# Altium schematic sheet senior_board_rev1.SchDoc
size 939 x 508 mm
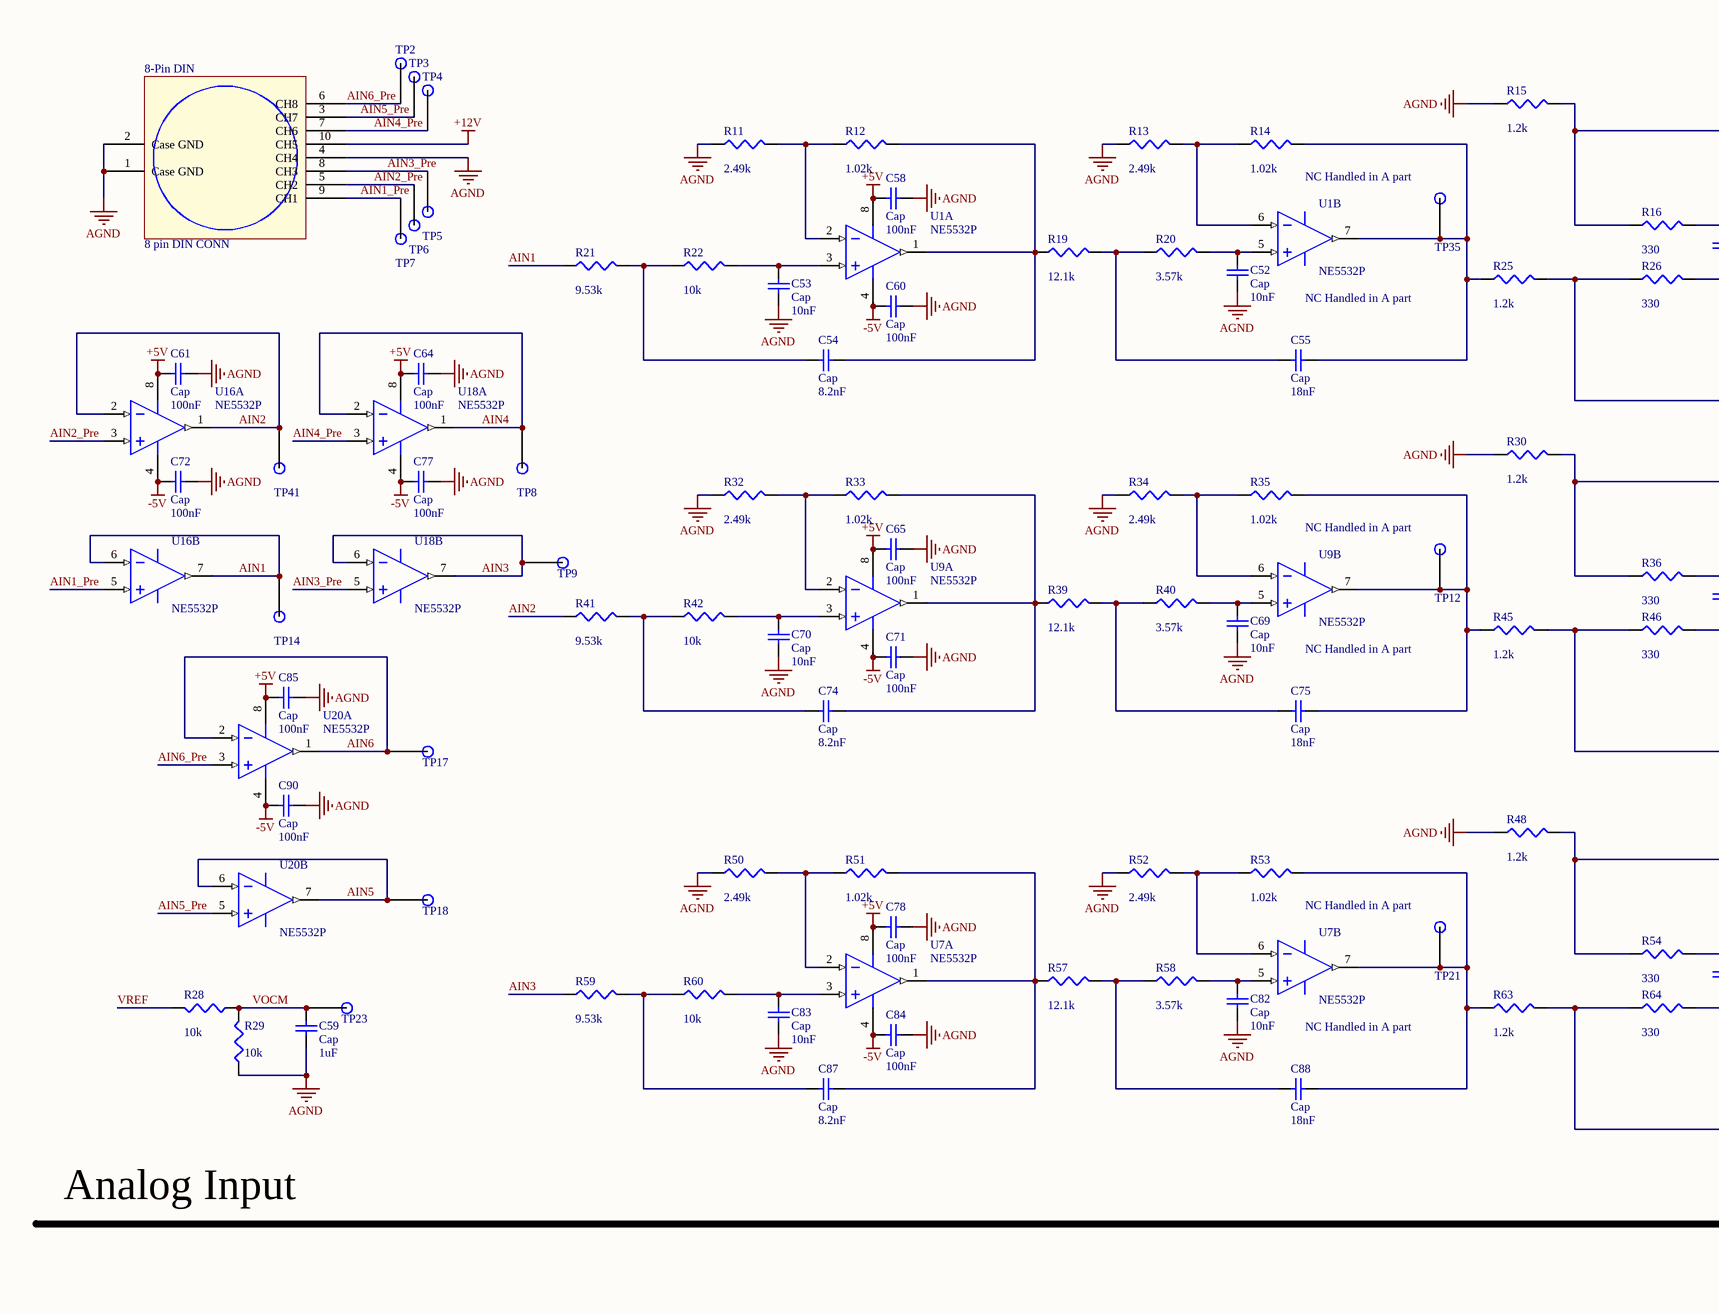
[diagram p0: senior_board_rev1.SchDoc, top left]
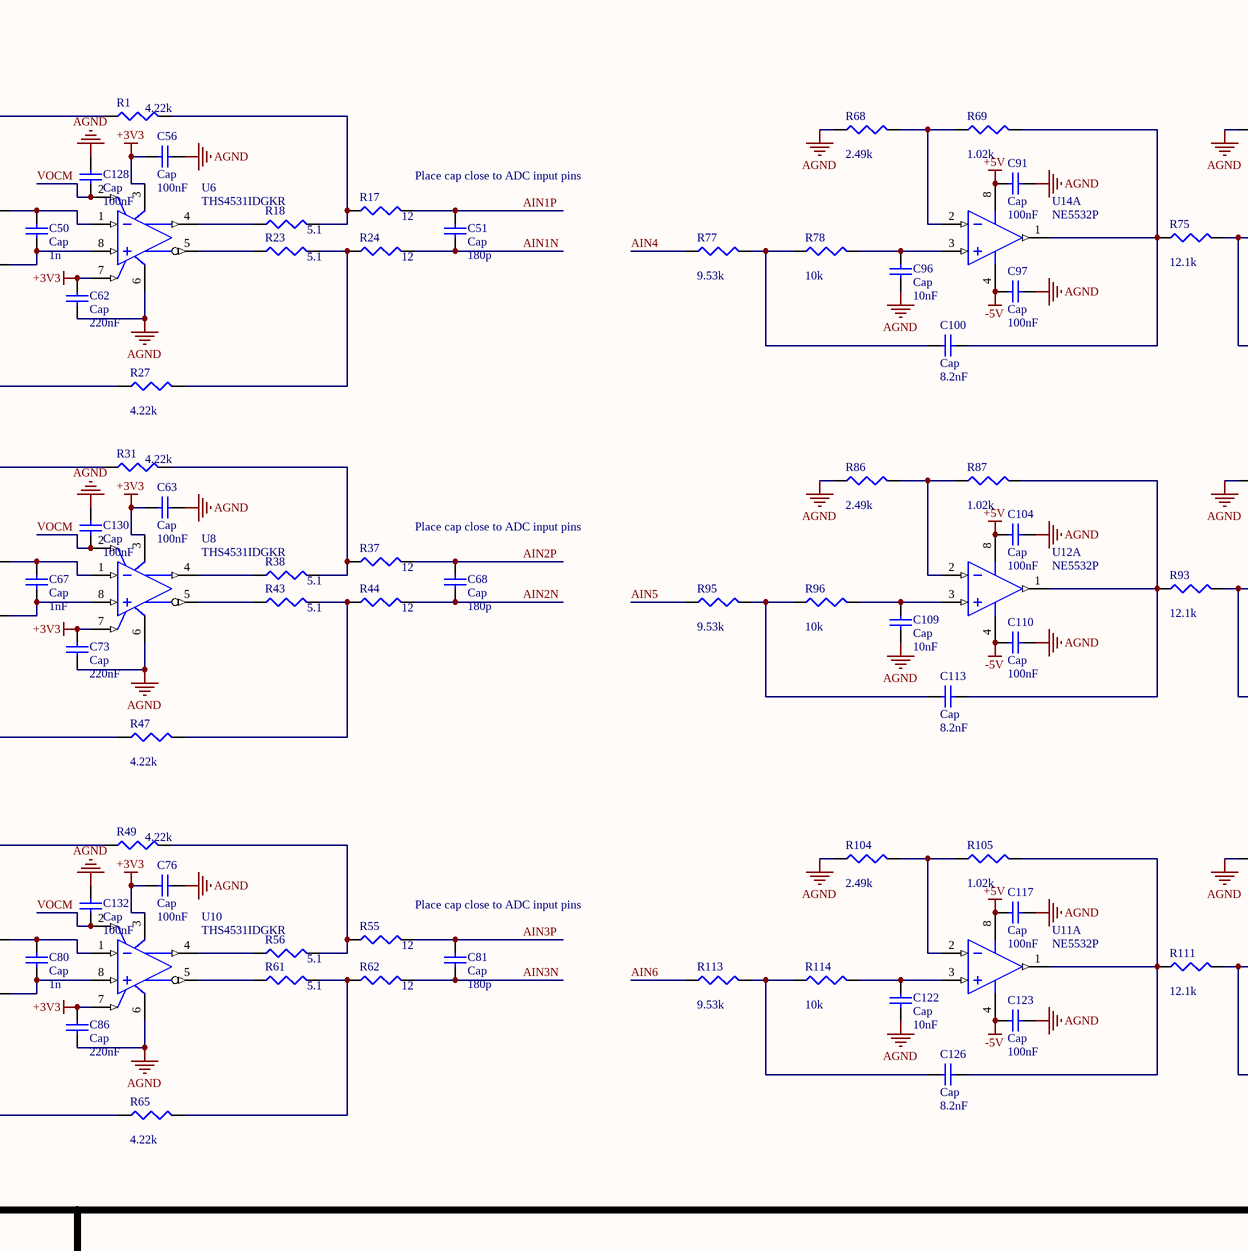
[diagram p1: senior_board_rev1.SchDoc, top middle]
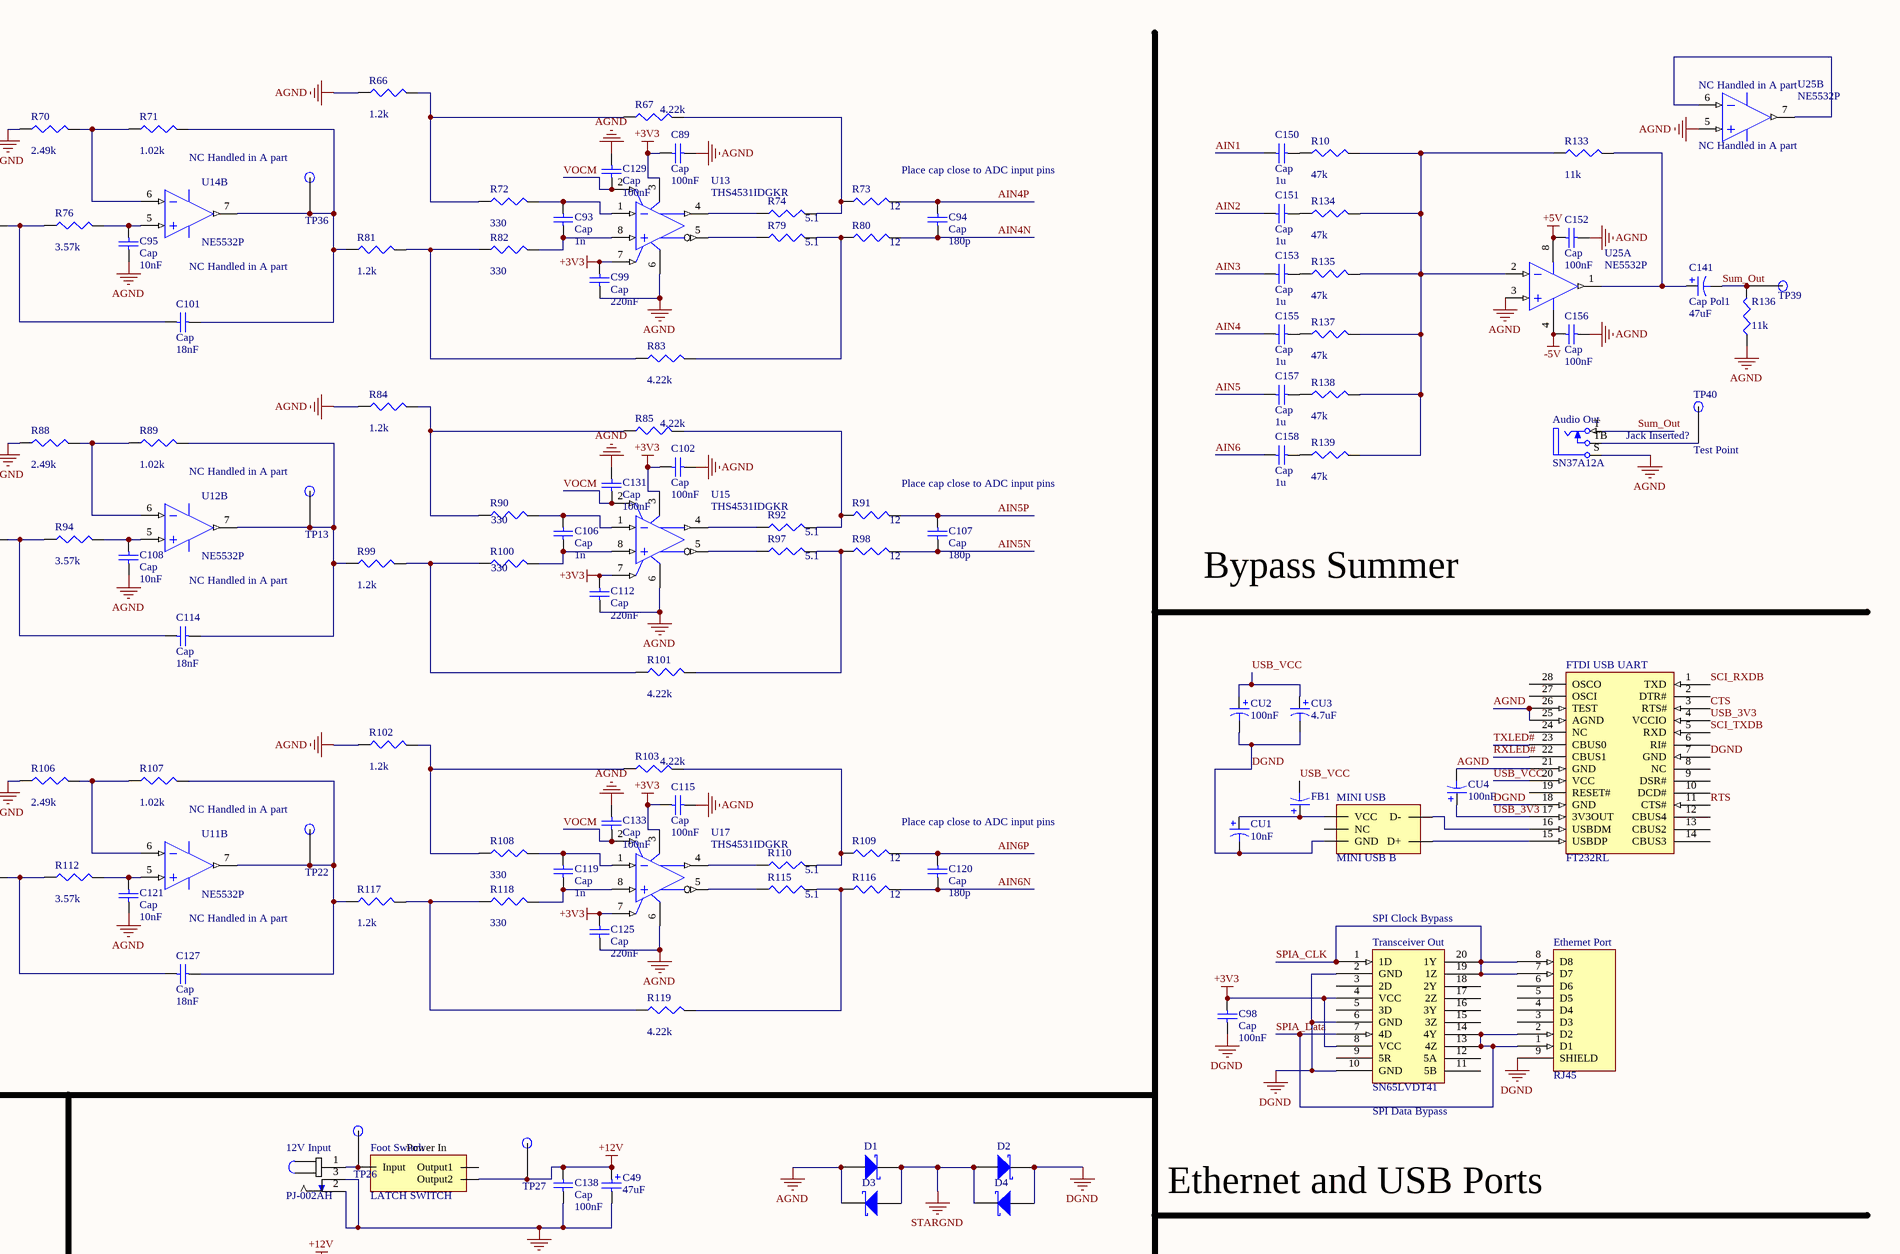
[diagram p2: senior_board_rev1.SchDoc, top right]
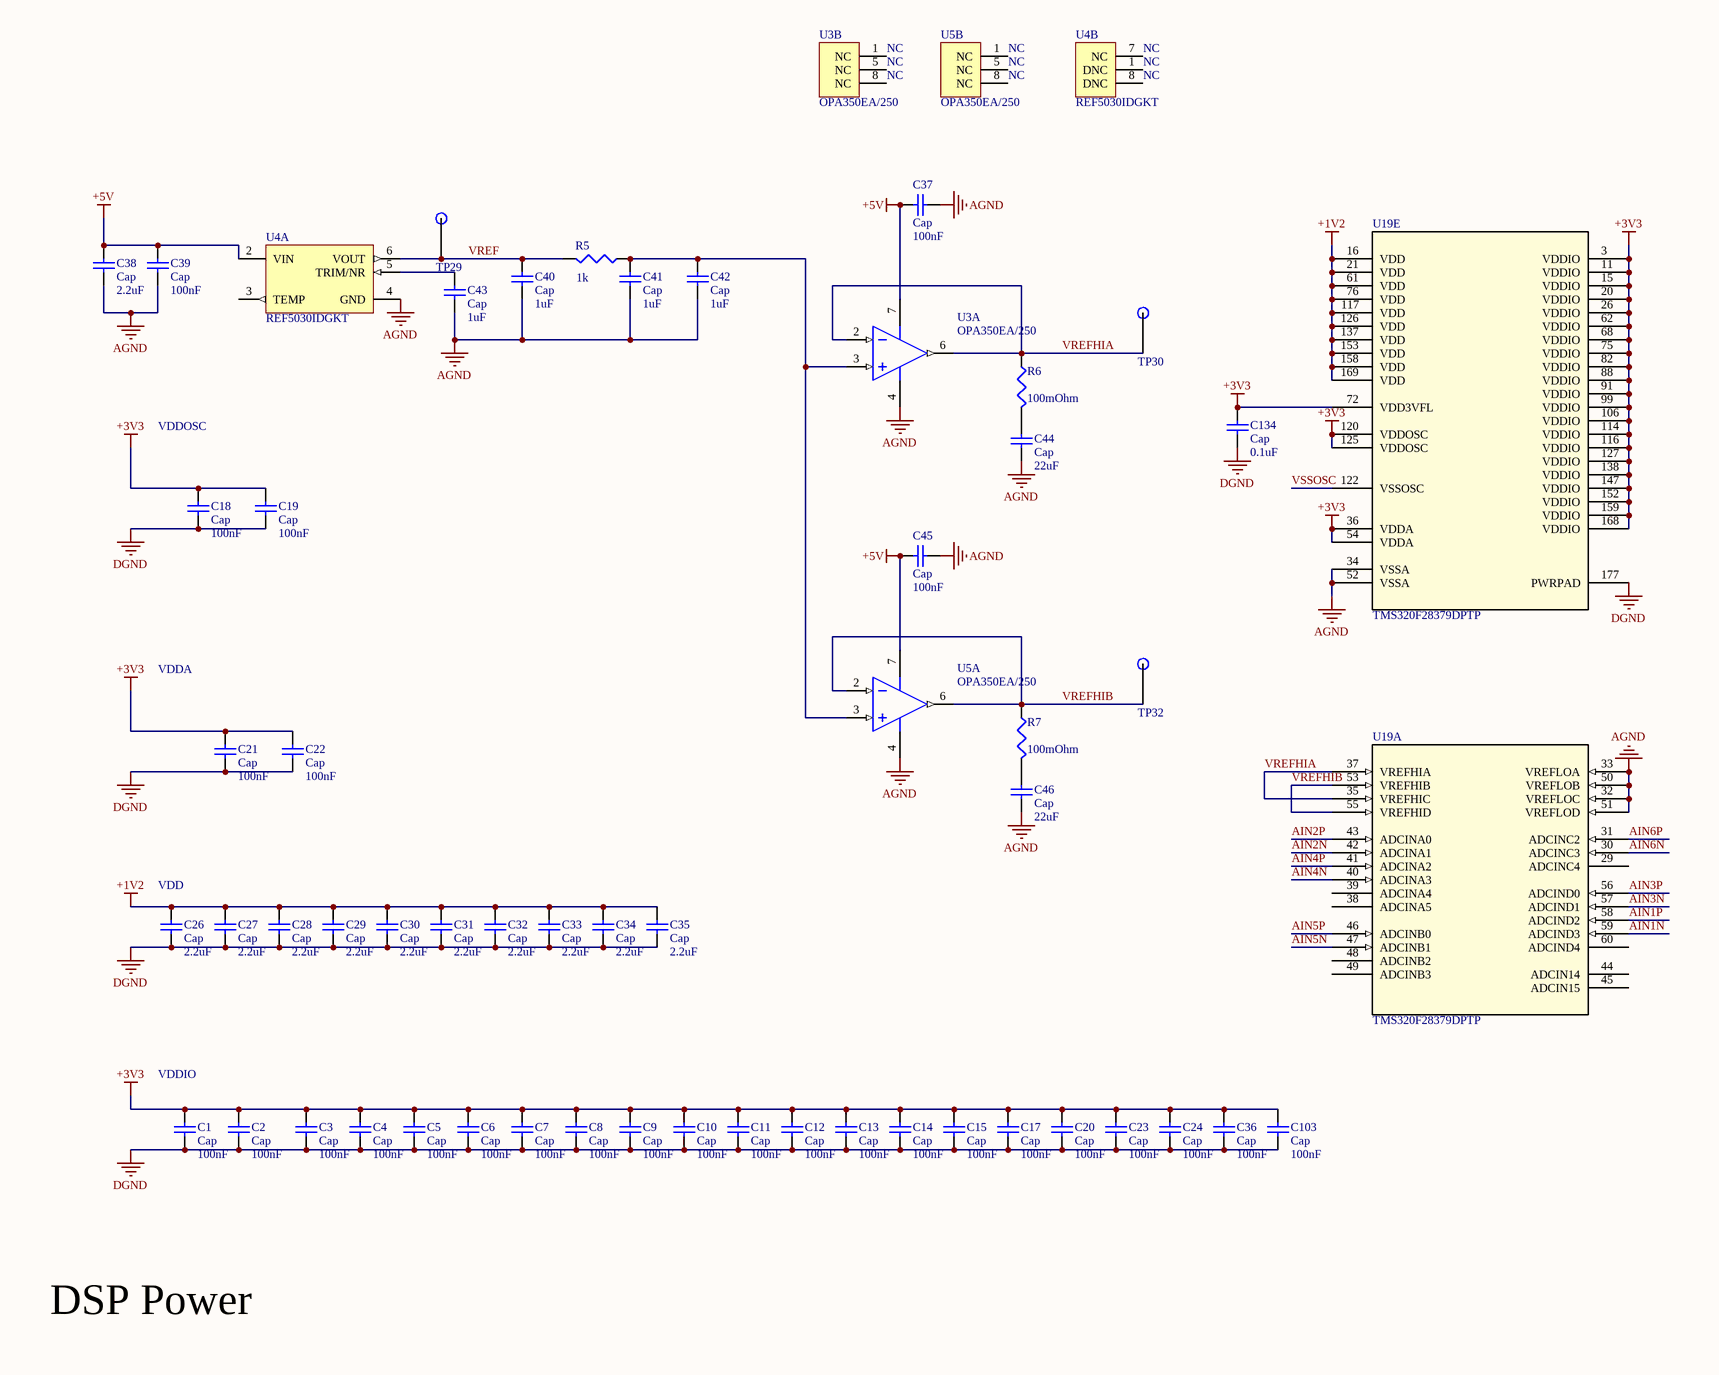
[diagram p3: senior_board_rev1.SchDoc, bottom left]
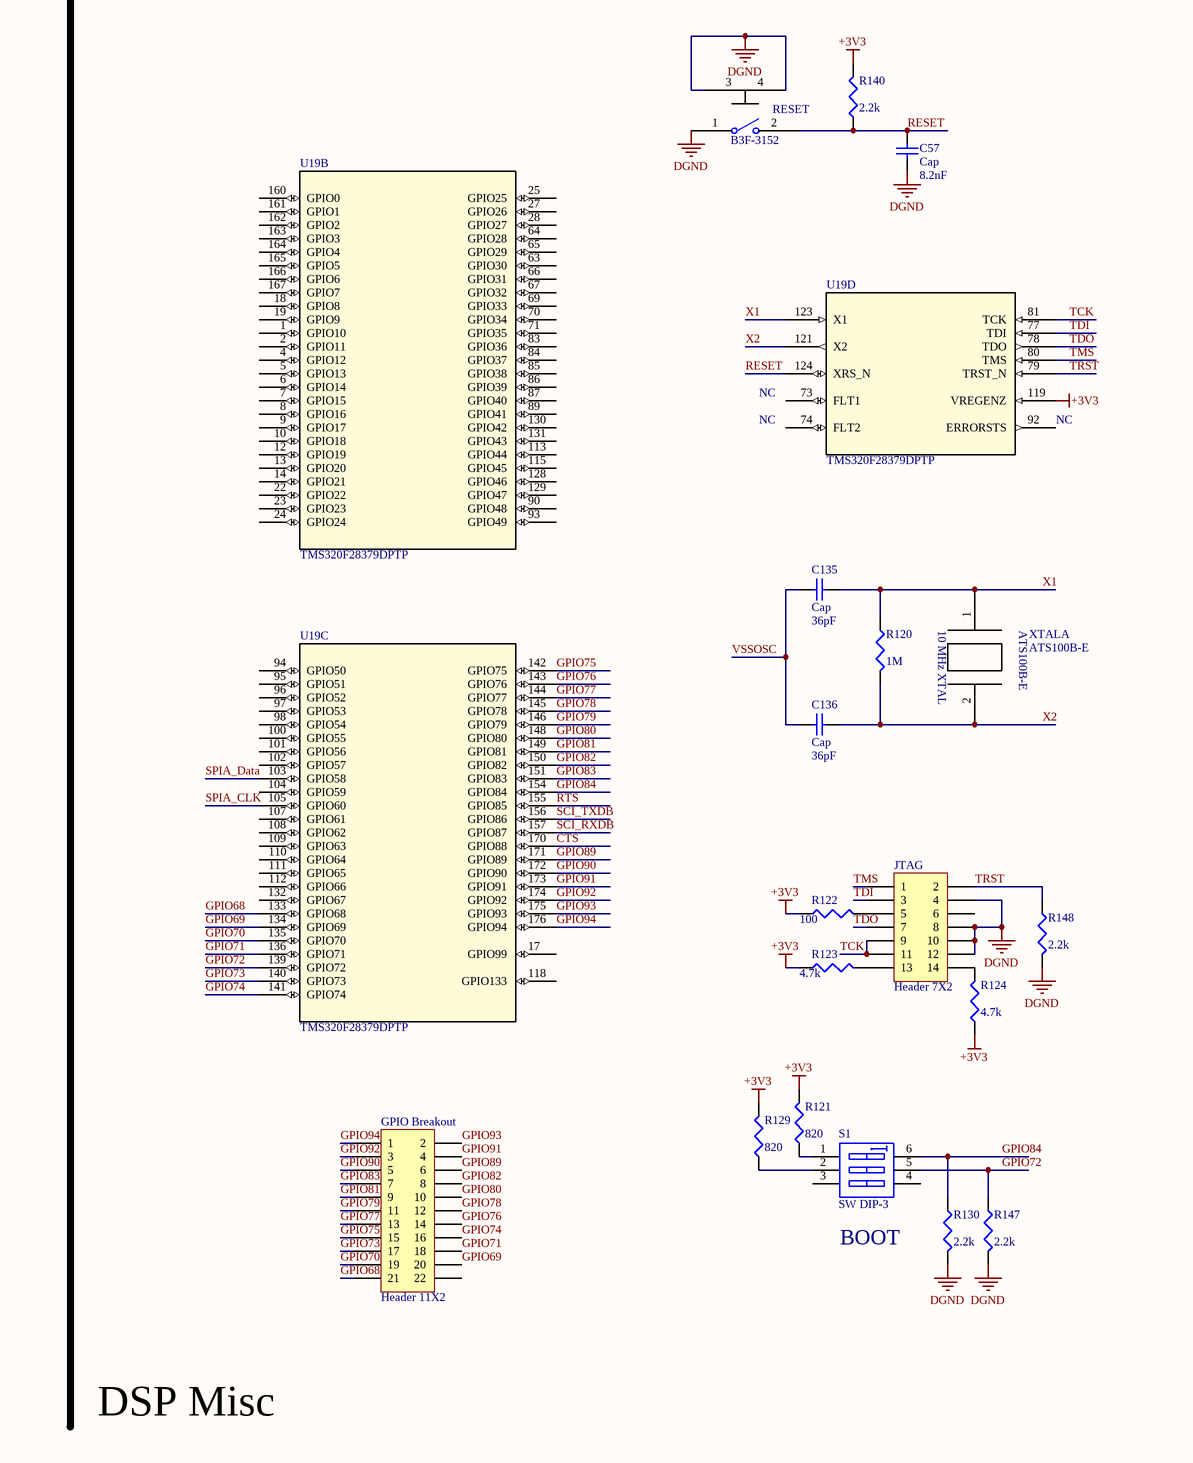
[diagram p4: senior_board_rev1.SchDoc, bottom middle]
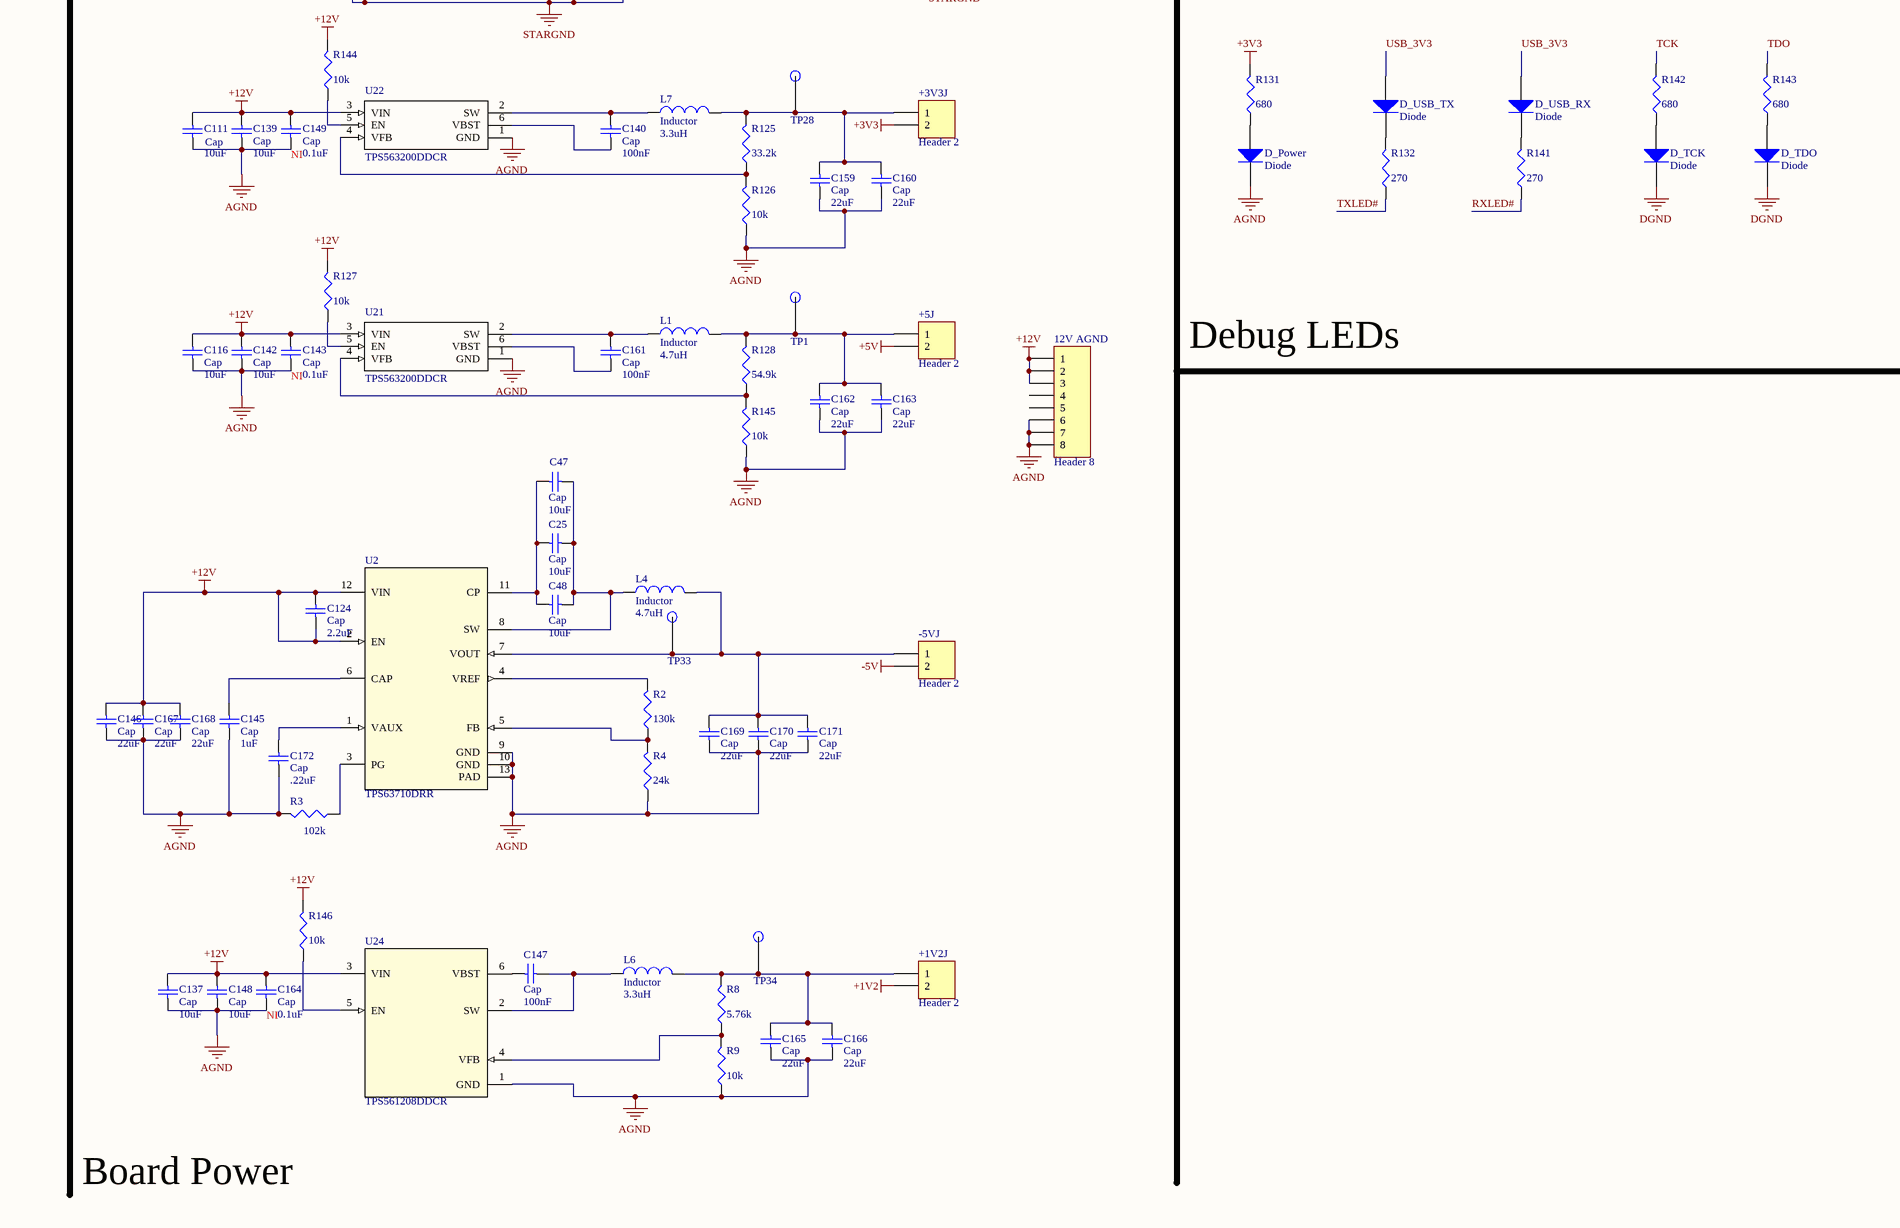
[diagram p5: senior_board_rev1.SchDoc, bottom right]

## Parts
8-Pin_DIN  8 pin DIN CONN  [8 Pin DIN Conn]
12V_AGND  Header 8  [HDR1X8]
12V_Input  PJ-002AH  [PJ-002AH]
+1V2J  Header 2  [HDR1X2]
+3V3J  Header 2  [HDR1X2]
+5J  Header 2  [HDR1X2]
-5VJ  Header 2  [HDR1X2]
Audio_Out  SN37A12A  [SN37A12A]
C1  Cap  value 100nF  [6-0805_N]
C2  Cap  value 100nF  [6-0805_N]
C3  Cap  value 100nF  [6-0805_N]
C4  Cap  value 100nF  [6-0805_N]
C5  Cap  value 100nF  [6-0805_N]
C6  Cap  value 100nF  [6-0805_N]
C7  Cap  value 100nF  [6-0805_N]
C8  Cap  value 100nF  [6-0805_N]
C9  Cap  value 100nF  [6-0805_N]
C10  Cap  value 100nF  [6-0805_N]
C11  Cap  value 100nF  [6-0805_N]
C12  Cap  value 100nF  [6-0805_N]
C13  Cap  value 100nF  [6-0805_N]
C14  Cap  value 100nF  [6-0805_N]
C15  Cap  value 100nF  [6-0805_N]
C17  Cap  value 100nF  [6-0805_N]
C18  Cap  value 100nF  [6-0805_N]
C19  Cap  value 100nF  [6-0805_N]
C20  Cap  value 100nF  [6-0805_N]
C21  Cap  value 100nF  [6-0805_N]
C22  Cap  value 100nF  [6-0805_N]
C23  Cap  value 100nF  [6-0805_N]
C24  Cap  value 100nF  [6-0805_N]
C25  Cap  value 10uF  [6-0805_N]
C26  Cap  value 2.2uF  [6-0805_N]
C27  Cap  value 2.2uF  [6-0805_N]
C28  Cap  value 2.2uF  [6-0805_N]
C29  Cap  value 2.2uF  [6-0805_N]
C30  Cap  value 2.2uF  [6-0805_N]
C31  Cap  value 2.2uF  [6-0805_N]
C32  Cap  value 2.2uF  [6-0805_N]
C33  Cap  value 2.2uF  [6-0805_N]
C34  Cap  value 2.2uF  [6-0805_N]
C35  Cap  value 2.2uF  [6-0805_N]
C36  Cap  value 100nF  [6-0805_N]
C37  Cap  value 100nF  [6-0805_N]
C38  Cap  value 2.2uF  [6-0805_N]
C39  Cap  value 100nF  [6-0805_N]
C40  Cap  value 1uF  [6-0805_N]
C41  Cap  value 1uF  [6-0805_N]
C42  Cap  value 1uF  [6-0805_N]
C43  Cap  value 1uF  [6-0805_N]
C44  Cap  value 22uF  [6-0805_N]
C45  Cap  value 100nF  [6-0805_N]
C46  Cap  value 22uF  [6-0805_N]
C47  Cap  value 10uF  [6-0805_N]
C48  Cap  value 10uF  [6-0805_N]
C49  47uF  [UUQ1C470MCL1GB]
C50  Cap  value 1n  [6-0805_N]
C51  Cap  value 180p  [6-0805_N]
C52  Cap  value 10nF  [6-0805_N]
C53  Cap  value 10nF  [6-0805_N]
C54  Cap  value 8.2nF  [6-0805_N]
C55  Cap  value 18nF  [6-0805_N]
C56  Cap  value 100nF  [6-0805_N]
C57  Cap  value 8.2nF  [6-0805_N]
C58  Cap  value 100nF  [6-0805_N]
C59  Cap  value 1uF  [6-0805_N]
C60  Cap  value 100nF  [6-0805_N]
C61  Cap  value 100nF  [6-0805_N]
C62  Cap  value 220nF  [6-0805_N]
C63  Cap  value 100nF  [6-0805_N]
C64  Cap  value 100nF  [6-0805_N]
C65  Cap  value 100nF  [6-0805_N]
C67  Cap  value 1nF  [6-0805_N]
C68  Cap  value 180p  [6-0805_N]
C69  Cap  value 10nF  [6-0805_N]
C70  Cap  value 10nF  [6-0805_N]
C71  Cap  value 100nF  [6-0805_N]
C72  Cap  value 100nF  [6-0805_N]
C73  Cap  value 220nF  [6-0805_N]
C74  Cap  value 8.2nF  [6-0805_N]
C75  Cap  value 18nF  [6-0805_N]
C76  Cap  value 100nF  [6-0805_N]
C77  Cap  value 100nF  [6-0805_N]
C78  Cap  value 100nF  [6-0805_N]
C80  Cap  value 1n  [6-0805_N]
C81  Cap  value 180p  [6-0805_N]
C82  Cap  value 10nF  [6-0805_N]
C83  Cap  value 10nF  [6-0805_N]
C84  Cap  value 100nF  [6-0805_N]
C85  Cap  value 100nF  [6-0805_N]
C86  Cap  value 220nF  [6-0805_N]
C87  Cap  value 8.2nF  [6-0805_N]
C88  Cap  value 18nF  [6-0805_N]
C89  Cap  value 100nF  [6-0805_N]
C90  Cap  value 100nF  [6-0805_N]
C91  Cap  value 100nF  [6-0805_N]
C93  Cap  value 1n  [6-0805_N]
C94  Cap  value 180p  [6-0805_N]
C95  Cap  value 10nF  [6-0805_N]
C96  Cap  value 10nF  [6-0805_N]
C97  Cap  value 100nF  [6-0805_N]
C98  Cap  value 100nF  [6-0805_N]
C99  Cap  value 220nF  [6-0805_N]
C100  Cap  value 8.2nF  [6-0805_N]
C101  Cap  value 18nF  [6-0805_N]
C102  Cap  value 100nF  [6-0805_N]
C103  Cap  value 100nF  [6-0805_N]
C104  Cap  value 100nF  [6-0805_N]
C106  Cap  value 1n  [6-0805_N]
C107  Cap  value 180p  [6-0805_N]
C108  Cap  value 10nF  [6-0805_N]
C109  Cap  value 10nF  [6-0805_N]
C110  Cap  value 100nF  [6-0805_N]
C111  Cap  value 10uF  [6-0805_N]
C112  Cap  value 220nF  [6-0805_N]
C113  Cap  value 8.2nF  [6-0805_N]
C114  Cap  value 18nF  [6-0805_N]
C115  Cap  value 100nF  [6-0805_N]
C116  Cap  value 10uF  [6-0805_N]
C117  Cap  value 100nF  [6-0805_N]
C119  Cap  value 1n  [6-0805_N]
C120  Cap  value 180p  [6-0805_N]
C121  Cap  value 10nF  [6-0805_N]
C122  Cap  value 10nF  [6-0805_N]
C123  Cap  value 100nF  [6-0805_N]
C124  Cap  value 2.2uF  [6-0805_N]
C125  Cap  value 220nF  [6-0805_N]
C126  Cap  value 8.2nF  [6-0805_N]
C127  Cap  value 18nF  [6-0805_N]
C128  Cap  value 100nF  [6-0805_N]
C129  Cap  value 100nF  [6-0805_N]
C130  Cap  value 100nF  [6-0805_N]
C131  Cap  value 100nF  [6-0805_N]
C132  Cap  value 100nF  [6-0805_N]
C133  Cap  value 100nF  [6-0805_N]
C134  Cap  value 0.1uF  [6-0805_N]
C135  Cap  value 36pF  [6-0805_N]
C136  Cap  value 36pF  [6-0805_N]
C137  Cap  value 10uF  [6-0805_N]
C138  Cap  value 100nF  [6-0805_N]
C139  Cap  value 10uF  [6-0805_N]
C140  Cap  value 100nF  [6-0805_N]
C141  Cap Pol1  value 47uF  [UUQ1C470MCL1GB]
C142  Cap  value 10uF  [6-0805_N]
C143  Cap  value 0.1uF  [6-0805_N]
C145  Cap  value 1uF  [6-0805_N]
C146  Cap  value 22uF  [6-0805_N]
C147  Cap  value 100nF  [6-0805_N]
C148  Cap  value 10uF  [6-0805_N]
C149  Cap  value 0.1uF  [6-0805_N]
C150  Cap  value 1u  [6-0805_N]
C151  Cap  value 1u  [6-0805_N]
C152  Cap  value 100nF  [6-0805_N]
C153  Cap  value 1u  [6-0805_N]
C155  Cap  value 1u  [6-0805_N]
C156  Cap  value 100nF  [6-0805_N]
C157  Cap  value 1u  [6-0805_N]
C158  Cap  value 1u  [6-0805_N]
C159  Cap  value 22uF  [6-0805_N]
C160  Cap  value 22uF  [6-0805_N]
C161  Cap  value 100nF  [6-0805_N]
C162  Cap  value 22uF  [6-0805_N]
C163  Cap  value 22uF  [6-0805_N]
C164  Cap  value 0.1uF  [6-0805_N]
C165  Cap  value 22uF  [6-0805_N]
C166  Cap  value 22uF  [6-0805_N]
C167  Cap  value 22uF  [6-0805_N]
C168  Cap  value 22uF  [6-0805_N]
C169  Cap  value 22uF  [6-0805_N]
C170  Cap  value 22uF  [6-0805_N]
C171  Cap  value 22uF  [6-0805_N]
C172  Cap  value .22uF  [6-0805_N]
CU1  value 10nF  [C0805]  (hidden comment: Cap Pol3)
CU2  value 100nF  [C0805]  (hidden comment: Cap Pol3)
CU3  value 4.7uF  [C0805]  (hidden comment: Cap Pol3)
CU4  value 100nF  [C0805]  (hidden comment: Cap Pol3)
D1  Diode BAT17  [Shotky]  (value not drawn)
D2  Diode BAT17  [Shotky]  (value not drawn)
D3  Diode BAT17  [Shotky]  (value not drawn)
D4  Diode BAT17  [Shotky]  (value not drawn)
D_Power  Diode  [C1206]
D_TCK  Diode  [C1206]
D_TDO  Diode  [C1206]
D_USB_RX  Diode  [C1206]
D_USB_TX  Diode  [C1206]
Ethernet_Port  RJ45  [RJ45]
FB1  (no value)  [C0805]
Foot_Switch  LATCH SWITCH  [FOOTSWITCH]
FTDI_USB_UART  FT232RL  [FT232R]
GPIO_Breakout  Header 11X2  [HDR2X11]
JTAG  Header 7X2  [HDR2X7]
L1  Inductor  value 4.7uH  [FIXED IND 4.7UH]
L4  Inductor  value 4.7uH  [FIXED IND 4.7UH]
L6  Inductor  value 3.3uH  [FIXED IND 4.7UH]
L7  Inductor  value 3.3uH  [FIXED IND 4.7UH]
MINI_USB  MINI USB B  [MINI USB B]
R1  value 4.22k  [6-0805_N]
R2  value 130k  [6-0805_N]
R3  value 102k  [6-0805_N]
R4  value 24k  [6-0805_N]
R5  value 1k  [6-0805_N]
R6  value 100mOhm  [6-0805_N]
R7  value 100mOhm  [6-0805_N]
R8  value 5.76k  [6-0805_N]
R9  value 10k  [6-0805_N]
R10  value 47k  [6-0805_N]
R11  value 2.49k  [6-0805_N]
R12  value 1.02k  [6-0805_N]
R13  value 2.49k  [6-0805_N]
R14  value 1.02k  [6-0805_N]
R15  value 1.2k  [6-0805_N]
R16  value 330  [6-0805_N]
R17  value 12  [6-0805_N]
R18  value 5.1  [6-0805_N]
R19  value 12.1k  [6-0805_N]
R20  value 3.57k  [6-0805_N]
R21  value 9.53k  [6-0805_N]
R22  value 10k  [6-0805_N]
R23  value 5.1  [6-0805_N]
R24  value 12  [6-0805_N]
R25  value 1.2k  [6-0805_N]
R26  value 330  [6-0805_N]
R27  value 4.22k  [6-0805_N]
R28  value 10k  [6-0805_N]
R29  value 10k  [6-0805_N]
R30  value 1.2k  [6-0805_N]
R31  value 4.22k  [6-0805_N]
R32  value 2.49k  [6-0805_N]
R33  value 1.02k  [6-0805_N]
R34  value 2.49k  [6-0805_N]
R35  value 1.02k  [6-0805_N]
R36  value 330  [6-0805_N]
R37  value 12  [6-0805_N]
R38  value 5.1  [6-0805_N]
R39  value 12.1k  [6-0805_N]
R40  value 3.57k  [6-0805_N]
R41  value 9.53k  [6-0805_N]
R42  value 10k  [6-0805_N]
R43  value 5.1  [6-0805_N]
R44  value 12  [6-0805_N]
R45  value 1.2k  [6-0805_N]
R46  value 330  [6-0805_N]
R47  value 4.22k  [6-0805_N]
R48  value 1.2k  [6-0805_N]
R49  value 4.22k  [6-0805_N]
R50  value 2.49k  [6-0805_N]
R51  value 1.02k  [6-0805_N]
R52  value 2.49k  [6-0805_N]
R53  value 1.02k  [6-0805_N]
R54  value 330  [6-0805_N]
R55  value 12  [6-0805_N]
R56  value 5.1  [6-0805_N]
R57  value 12.1k  [6-0805_N]
R58  value 3.57k  [6-0805_N]
R59  value 9.53k  [6-0805_N]
R60  value 10k  [6-0805_N]
R61  value 5.1  [6-0805_N]
R62  value 12  [6-0805_N]
R63  value 1.2k  [6-0805_N]
R64  value 330  [6-0805_N]
R65  value 4.22k  [6-0805_N]
R66  value 1.2k  [6-0805_N]
R67  value 4.22k  [6-0805_N]
R68  value 2.49k  [6-0805_N]
R69  value 1.02k  [6-0805_N]
R70  value 2.49k  [6-0805_N]
R71  value 1.02k  [6-0805_N]
R72  value 330  [6-0805_N]
R73  value 12  [6-0805_N]
R74  value 5.1  [6-0805_N]
R75  value 12.1k  [6-0805_N]
R76  value 3.57k  [6-0805_N]
R77  value 9.53k  [6-0805_N]
R78  value 10k  [6-0805_N]
R79  value 5.1  [6-0805_N]
R80  value 12  [6-0805_N]
R81  value 1.2k  [6-0805_N]
R82  value 330  [6-0805_N]
R83  value 4.22k  [6-0805_N]
R84  value 1.2k  [6-0805_N]
R85  value 4.22k  [6-0805_N]
R86  value 2.49k  [6-0805_N]
R87  value 1.02k  [6-0805_N]
R88  value 2.49k  [6-0805_N]
R89  value 1.02k  [6-0805_N]
R90  value 330  [6-0805_N]
R91  value 12  [6-0805_N]
R92  value 5.1  [6-0805_N]
R93  value 12.1k  [6-0805_N]
R94  value 3.57k  [6-0805_N]
R95  value 9.53k  [6-0805_N]
R96  value 10k  [6-0805_N]
R97  value 5.1  [6-0805_N]
R98  value 12  [6-0805_N]
R99  value 1.2k  [6-0805_N]
R100  value 330  [6-0805_N]
R101  value 4.22k  [6-0805_N]
R102  value 1.2k  [6-0805_N]
R103  value 4.22k  [6-0805_N]
R104  value 2.49k  [6-0805_N]
R105  value 1.02k  [6-0805_N]
R106  value 2.49k  [6-0805_N]
R107  value 1.02k  [6-0805_N]
R108  value 330  [6-0805_N]
R109  value 12  [6-0805_N]
R110  value 5.1  [6-0805_N]
R111  value 12.1k  [6-0805_N]
R112  value 3.57k  [6-0805_N]
R113  value 9.53k  [6-0805_N]
R114  value 10k  [6-0805_N]
R115  value 5.1  [6-0805_N]
R116  value 12  [6-0805_N]
R117  value 1.2k  [6-0805_N]
R118  value 330  [6-0805_N]
R119  value 4.22k  [6-0805_N]
R120  value 1M  [6-0805_N]
R121  value 820  [6-0805_N]
R122  value 100  [6-0805_N]
R123  value 4.7k  [6-0805_N]
R124  value 4.7k  [6-0805_N]
R125  value 33.2k  [6-0805_N]
R126  value 10k  [6-0805_N]
R127  value 10k  [6-0805_N]
R128  value 54.9k  [6-0805_N]
R129  value 820  [6-0805_N]
R130  value 2.2k  [6-0805_N]
R131  value 680  [6-0805_N]
R132  value 270  [6-0805_N]
R133  value 11k  [AXIAL-0.3]
R134  value 47k  [6-0805_N]
R135  value 47k  [6-0805_N]
R136  value 11k  [AXIAL-0.3]
R137  value 47k  [6-0805_N]
R138  value 47k  [6-0805_N]
R139  value 47k  [6-0805_N]
R140  value 2.2k  [6-0805_N]
R141  value 270  [6-0805_N]
R142  value 680  [6-0805_N]
R143  value 680  [6-0805_N]
R144  value 10k  [6-0805_N]
R145  value 10k  [6-0805_N]
R146  value 10k  [6-0805_N]
R147  value 2.2k  [6-0805_N]
R148  value 2.2k  [6-0805_N]
RESET  B3F-3152  [B3F-3152]
S1  SW DIP-3  [Gull Wing Switch]
TP1  Test Point  [Test Point]  (value not drawn)
TP2  Test Point  [Test Point]  (value not drawn)
TP3  Test Point  [Test Point]  (value not drawn)
TP4  Test Point  [Test Point]  (value not drawn)
TP5  Test Point  [Test Point]  (value not drawn)
TP6  Test Point  [Test Point]  (value not drawn)
TP7  Test Point  [Test Point]  (value not drawn)
TP8  Test Point  [Test Point]  (value not drawn)
TP9  Test Point  [Test Point]  (value not drawn)
TP12  Test Point  [Test Point]  (value not drawn)
TP13  Test Point  [Test Point]  (value not drawn)
TP14  Test Point  [Test Point]  (value not drawn)
TP17  Test Point  [Test Point]  (value not drawn)
TP18  Test Point  [Test Point]  (value not drawn)
TP21  Test Point  [Test Point]  (value not drawn)
TP22  Test Point  [Test Point]  (value not drawn)
TP23  Test Point  [Test Point]  (value not drawn)
TP26  Test Point  [Test Point]  (value not drawn)
TP27  Test Point  [Test Point]  (value not drawn)
TP28  Test Point  [Test Point]  (value not drawn)
TP29  Test Point  [Test Point]  (value not drawn)
TP30  Test Point  [Test Point]  (value not drawn)
TP32  Test Point  [Test Point]  (value not drawn)
TP33  Test Point  [Test Point]  (value not drawn)
TP34  Test Point  [Test Point]  (value not drawn)
TP35  Test Point  [Test Point]  (value not drawn)
TP36  Test Point  [Test Point]  (value not drawn)
TP39  Test Point  [Test Point]  (value not drawn)
TP40  Test Point  [Test Point]
TP41  Test Point  [Test Point]  (value not drawn)
Transceiver_Out  SN65LVDT41  [SN65LVDT41]
U1  NE5532P  [TI-P8]  (parts A,B of 2)
U2  TPS63710DRR  [DRR0012C]
U3  OPA350EA/250  [TI-DGK8_N]  (parts A,B of 2)
U4  REF5030IDGKT  [TI-DGK8_N]  (parts A,B of 2)
U5  OPA350EA/250  [TI-DGK8_N]  (parts A,B of 2)
U6  THS4531IDGKR  [TI-DGK8_N]
U7  NE5532P  [TI-P8]  (parts A,B of 2)
U8  THS4531IDGKR  [TI-DGK8_N]
U9  NE5532P  [TI-P8]  (parts A,B of 2)
U10  THS4531IDGKR  [TI-DGK8_N]
U11  NE5532P  [TI-P8]  (parts A,B of 2)
U12  NE5532P  [TI-P8]  (parts A,B of 2)
U13  THS4531IDGKR  [TI-DGK8_N]
U14  NE5532P  [TI-P8]  (parts A,B of 2)
U15  THS4531IDGKR  [TI-DGK8_N]
U16  NE5532P  [TI-P8]  (parts A,B of 2)
U17  THS4531IDGKR  [TI-DGK8_N]
U18  NE5532P  [TI-P8]  (parts A,B of 2)
U19  TMS320F28379DPTP  [PTP0176F_N]  (parts A,B,C,D,E of 5)
U20  NE5532P  [TI-P8]  (parts A,B of 2)
U21  TPS563200DDCR  [DDC0006A]
U22  TPS563200DDCR  [DDC0006A]
U24  TPS561208DDCR  [DDC0006A]
U25  NE5532P  [TI-P8]  (parts A,B of 2)
XTALA  ATS100B-E  [ATS XTAL]

## Nets
+1V2: +1V2J.2 C26.1 C27.1 C28.1 C29.1 C30.1 C31.1 C32.1 C33.1 C34.1 C35.1 U19.16(VDD) U19.21(VDD) U19.61(VDD) U19.76(VDD) U19.117(VDD) U19.126(VDD) U19.137(VDD) U19.153(VDD) U19.158(VDD) U19.169(VDD)
+3V3: +3V3J.2 C1.1 C2.1 C3.1 C4.1 C5.1 C6.1 C7.1 C8.1 C9.1 C10.1 C11.1 C12.1 C13.1 C14.1 C15.1 C17.1 C18.1 C19.1 C20.1 C21.1 C22.1 C23.1 C24.1 C36.1 C56.1 C62.1 C63.1 C73.1 C76.1 C86.1 C89.1 C98.1 C99.1 C102.1 C103.1 C112.1 C115.1 C125.1 C134.2 R121.2 R122.1 R123.1 R124.1 R129.2 R131.2 R140.2 Transceiver_Out.4(VCC) Transceiver_Out.8(VCC) U6.3(VS+) U6.7(~{PD}) U8.3(VS+) U8.7(~{PD}) U10.3(VS+) U10.7(~{PD}) U13.3(VS+) U13.7(~{PD}) U15.3(VS+) U15.7(~{PD}) U17.3(VS+) U17.7(~{PD}) U19.3(VDDIO) U19.11(VDDIO) U19.15(VDDIO) U19.20(VDDIO) U19.26(VDDIO) U19.36(VDDA) U19.54(VDDA) U19.62(VDDIO) U19.68(VDDIO) U19.72(VDD3VFL) U19.75(VDDIO) U19.82(VDDIO) U19.88(VDDIO) U19.91(VDDIO) U19.99(VDDIO) U19.106(VDDIO) U19.114(VDDIO) U19.116(VDDIO) U19.119(VREGENZ) U19.120(VDDOSC) U19.125(VDDOSC) U19.127(VDDIO) U19.138(VDDIO) U19.147(VDDIO) U19.152(VDDIO) U19.159(VDDIO) U19.168(VDDIO)
+5V: +5J.2 C37.1 C38.1 C39.1 C45.1 C58.1 C61.1 C64.1 C65.1 C78.1 C85.1 C91.1 C104.1 C117.1 C152.1 U1.8(VCC+) U3.7(V+) U4.2(VIN) U5.7(V+) U7.8(VCC+) U9.8(VCC+) U11.8(VCC+) U12.8(VCC+) U14.8(VCC+) U16.8(VCC+) U18.8(VCC+) U20.8(VCC+) U25.8(VCC+)
+12V: 8-Pin_DIN.10(CH5) 12V_AGND.1 12V_AGND.2 12V_AGND.3 C49.1 C111.2 C116.2 C124.1 C124.2 C137.2 C138.2 C139.2 C142.2 C143.2 C146.2 C148.2 C149.2 C164.2 C167.2 C168.2 Foot_Switch.3(Output2) R127.2 R144.2 R146.2 TP27.TP(Test_Point) U2.2(EN) U2.12(VIN) U21.3(VIN) U22.3(VIN) U24.3(VIN)
-5V: -5VJ.2 C60.1 C71.1 C72.1 C77.1 C84.1 C90.1 C97.1 C110.1 C123.1 C156.1 U1.4(VCC-) U7.4(VCC-) U9.4(VCC-) U11.4(VCC-) U12.4(VCC-) U14.4(VCC-) U16.4(VCC-) U18.4(VCC-) U20.4(VCC-) U25.4(VCC-)
AGND: 8-Pin_DIN.1(Case_GND) 8-Pin_DIN.2(Case_GND) 8-Pin_DIN.4(CH4) 12V_AGND.6 12V_AGND.7 12V_AGND.8 Audio_Out.S C37.2 C38.2 C39.2 C40.2 C41.2 C42.2 C43.2 C44.2 C45.2 C46.2 C52.2 C53.2 C56.2 C58.2 C59.2 C60.2 C61.2 C62.2 C63.2 C64.2 C65.2 C69.2 C70.2 C71.2 C72.2 C73.2 C76.2 C77.2 C78.2 C82.2 C83.2 C84.2 C85.2 C86.2 C89.2 C90.2 C91.2 C95.2 C96.2 C97.2 C99.2 C102.2 C104.2 C108.2 C109.2 C110.2 C111.1 C112.2 C115.2 C116.1 C117.2 C121.2 C122.2 C123.2 C125.2 C128.2 C129.2 C130.2 C131.2 C132.2 C133.2 C137.1 C139.1 C142.1 C143.1 C145.1 C146.1 C148.1 C149.1 C152.2 C156.2 C159.1 C160.1 C162.1 C163.1 C164.1 C165.1 C166.1 C167.1 C168.1 C169.1 C170.1 C171.1 C172.1 CU4.2 D1.1(A) D3.2(K) D_Power.2(K) FTDI_USB_UART.21(GND) FTDI_USB_UART.25(AGND) FTDI_USB_UART.26(TEST) R3.2 R4.1 R9.1 R11.1 R13.1 R15.1 R29.1 R30.1 R32.1 R34.1 R48.1 R50.1 R52.1 R66.1 R68.1 R70.1 R84.1 R86.1 R88.1 R102.1 R104.1 R106.1 R126.1 R136.1 R145.1 U2.9(GND) U2.10(GND) U2.13(PAD) U3.4(V-) U4.4(GND) U5.4(V-) U6.6(VS-) U8.6(VS-) U10.6(VS-) U13.6(VS-) U15.6(VS-) U17.6(VS-) U19.32(VREFLOC) U19.33(VREFLOA) U19.34(VSSA) U19.50(VREFLOB) U19.51(VREFLOD) U19.52(VSSA) U21.1(GND) U22.1(GND) U24.1(GND) U25.3(IN1+) U25.5(IN2+)
DGND: C1.2 C2.2 C3.2 C4.2 C5.2 C6.2 C7.2 C8.2 C9.2 C10.2 C11.2 C12.2 C13.2 C14.2 C15.2 C17.2 C18.2 C19.2 C20.2 C21.2 C22.2 C23.2 C24.2 C26.2 C27.2 C28.2 C29.2 C30.2 C31.2 C32.2 C33.2 C34.2 C35.2 C36.2 C57.1 C98.2 C103.2 C134.1 CU1.2 CU2.2 CU3.2 D2.2(K) D4.1(A) D_TCK.2(K) D_TDO.2(K) Ethernet_Port.9(SHIELD) FTDI_USB_UART.7(GND) FTDI_USB_UART.18(GND) JTAG.4 JTAG.8 JTAG.10 JTAG.12 MINI_USB.5(GND) R130.1 R147.1 R148.1 RESET.1 RESET.3 RESET.4 Transceiver_Out.2(GND) Transceiver_Out.6(GND) Transceiver_Out.10(GND) U19.177(PWRPAD)
STARGND: 12V_Input.2 12V_Input.3 C49.2 C138.1 D1.2(K) D2.1(A) D3.1(A) D4.2(K)
AIN1: C150.1 R21.1 TP14.TP(Test_Point) U16.6(IN2-) U16.7(OUT2)
AIN1_Pre: 8-Pin_DIN.9(CH1) TP7.TP(Test_Point) U16.5(IN2+)
AIN1N: C51.2 R24.2 U19.59(ADCIND3)
AIN1P: C51.1 R17.2 U19.58(ADCIND2)
AIN2: C151.1 R41.1 TP41.TP(Test_Point) U16.1(OUT1) U16.2(IN1-)
AIN2_Pre: 8-Pin_DIN.5(CH2) TP6.TP(Test_Point) U16.3(IN1+)
AIN2N: C68.2 R44.2 U19.42(ADCINA1)
AIN2P: C68.1 R37.2 U19.43(ADCINA0)
AIN3: C153.1 R59.1 TP9.TP(Test_Point) U18.6(IN2-) U18.7(OUT2)
AIN3_Pre: 8-Pin_DIN.8(CH3) TP5.TP(Test_Point) U18.5(IN2+)
AIN3N: C81.2 R62.2 U19.57(ADCIND1)
AIN3P: C81.1 R55.2 U19.56(ADCIND0)
AIN4: C155.1 R77.1 TP8.TP(Test_Point) U18.1(OUT1) U18.2(IN1-)
AIN4_Pre: 8-Pin_DIN.7(CH6) TP4.TP(Test_Point) U18.3(IN1+)
AIN4N: C94.2 R80.2 U19.40(ADCINA3)
AIN4P: C94.1 R73.2 U19.41(ADCINA2)
AIN5: C157.1 R95.1 TP18.TP(Test_Point) U20.6(IN2-) U20.7(OUT2)
AIN5_Pre: 8-Pin_DIN.3(CH7) TP3.TP(Test_Point) U20.5(IN2+)
AIN5N: C107.2 R98.2 U19.47(ADCINB1)
AIN5P: C107.1 R91.2 U19.46(ADCINB0)
AIN6: C158.1 R113.1 TP17.TP(Test_Point) U20.1(OUT1) U20.2(IN1-)
AIN6_Pre: 8-Pin_DIN.6(CH8) TP2.TP(Test_Point) U20.3(IN1+)
AIN6N: C120.2 R116.2 U19.30(ADCINC3)
AIN6P: C120.1 R109.2 U19.31(ADCINC2)
CTS: FTDI_USB_UART.3(RTS#) U19.170(GPIO88)
GPIO68: GPIO_Breakout.21 U19.133(GPIO68)
GPIO69: GPIO_Breakout.20 U19.134(GPIO69)
GPIO70: GPIO_Breakout.19 U19.135(GPIO70)
GPIO71: GPIO_Breakout.18 U19.136(GPIO71)
GPIO72: R147.2 S1.5(B2) U19.139(GPIO72)
GPIO73: GPIO_Breakout.17 U19.140(GPIO73)
GPIO74: GPIO_Breakout.16 U19.141(GPIO74)
GPIO75: GPIO_Breakout.15 U19.142(GPIO75)
GPIO76: GPIO_Breakout.14 U19.143(GPIO76)
GPIO77: GPIO_Breakout.13 U19.144(GPIO77)
GPIO78: GPIO_Breakout.12 U19.145(GPIO78)
GPIO79: GPIO_Breakout.11 U19.146(GPIO79)
GPIO80: GPIO_Breakout.10 U19.148(GPIO80)
GPIO81: GPIO_Breakout.9 U19.149(GPIO81)
GPIO82: GPIO_Breakout.8 U19.150(GPIO82)
GPIO83: GPIO_Breakout.7 U19.151(GPIO83)
GPIO84: R130.2 S1.6(B1) U19.154(GPIO84)
GPIO89: GPIO_Breakout.6 U19.171(GPIO89)
GPIO90: GPIO_Breakout.5 U19.172(GPIO90)
GPIO91: GPIO_Breakout.4 U19.173(GPIO91)
GPIO92: GPIO_Breakout.3 U19.174(GPIO92)
GPIO93: GPIO_Breakout.2 U19.175(GPIO93)
GPIO94: GPIO_Breakout.1 U19.176(GPIO94)
RESET: C57.2 R140.1 RESET.2 U19.124(XRS_N)
RTS: FTDI_USB_UART.11(CTS#) U19.155(GPIO85)
RXLED#: FTDI_USB_UART.22(CBUS1) R141.1
SCI_RXDB: FTDI_USB_UART.1(TXD) U19.157(GPIO87)
SCI_TXDB: FTDI_USB_UART.5(RXD) U19.156(GPIO86)
SPIA_CLK: Ethernet_Port.7(D7) Ethernet_Port.8(D8) Transceiver_Out.1(1D) Transceiver_Out.19(1Z) Transceiver_Out.20(1Y) U19.105(GPIO60)
SPIA_Data: Ethernet_Port.1(D1) Ethernet_Port.2(D2) Transceiver_Out.7(4D) Transceiver_Out.13(4Z) Transceiver_Out.14(4Y) U19.103(GPIO58)
Sum_Out: Audio_Out.T C141.2 R136.2 TP39.TP(Test_Point)
TCK: JTAG.9 JTAG.11 R142.2 U19.81(TCK)
TDI: JTAG.3 U19.77(TDI)
TDO: JTAG.7 R143.2 U19.78(TDO)
TMS: JTAG.1 U19.80(TMS)
TRST: JTAG.2 R148.2 U19.79(TRST_N)
TXLED#: FTDI_USB_UART.23(CBUS0) R132.1
USB_3V3: CU4.1 D_USB_RX.1(A) D_USB_TX.1(A) FTDI_USB_UART.4(VCCIO) FTDI_USB_UART.17(3V3OUT)
USB_VCC: CU2.1 CU3.1 FB1.2 FTDI_USB_UART.20(VCC)
VOCM: C59.1 C128.1 C129.1 C130.1 C131.1 C132.1 C133.1 R28.1 R29.2 TP23.TP(Test_Point) U6.2(VOCM) U8.2(VOCM) U10.2(VOCM) U13.2(VOCM) U15.2(VOCM) U17.2(VOCM)
VREF: C40.1 R5.2 R28.2 TP29.TP(Test_Point) U4.6(VOUT)
VREFHIA: R6.1 TP30.TP(Test_Point) U3.2(IN-) U3.6(OUT) U19.35(VREFHIC) U19.37(VREFHIA)
VREFHIB: R7.1 TP32.TP(Test_Point) U5.2(IN-) U5.6(OUT) U19.53(VREFHIB) U19.55(VREFHID)
VSSOSC: C135.1 C136.1 U19.122(VSSOSC)
X1: C135.2 R120.1 U19.123(X1) XTALA.1
X2: C136.2 R120.2 U19.121(X2) XTALA.2
Net12V_Input_1: 12V_Input.1 Foot_Switch.1(Input) TP26.TP(Test_Point)
Net+1V2J_1: +1V2J.1 C165.2 C166.2 L6.2 R8.2 TP34.TP(Test_Point)
Net+3V3J_1: +3V3J.1 C159.2 C160.2 L7.2 R125.2 TP28.TP(Test_Point)
Net+5J_1: +5J.1 C162.2 C163.2 L1.2 R128.2 TP1.TP(Test_Point)
Net-5VJ_1: -5VJ.1 C169.2 C170.2 C171.2 L4.2 TP33.TP(Test_Point) U2.7(VOUT)
NetAudio_Out_TB: Audio_Out.TB TP40.TP(Test_Point)
NetC25_1: C25.1 C47.1 C48.1 L4.1 U2.8(SW)
NetC25_2: C25.2 C47.2 C48.2 U2.11(CP)
NetC41_1: C41.1 C42.1 R5.1 U3.3(IN+) U5.3(IN+)
NetC43_1: C43.1 U4.5(TRIM/NR)
NetC44_1: C44.1 R6.2
NetC46_1: C46.1 R7.2
NetC50_1: C50.1 R16.2 U6.1(VIN-)
NetC50_2: C50.2 R26.2 U6.8(VIN+)
NetC52_1: C52.1 R20.2 U1.5(IN2+)
NetC53_1: C53.1 R22.2 U1.3(IN1+)
NetC54_1: C54.1 R21.2 R22.1
NetC54_2: C54.2 R12.2 R19.1 U1.1(OUT1)
NetC55_1: C55.1 R19.2 R20.1
NetC55_2: C55.2 R14.2 R25.1 TP35.TP(Test_Point) U1.7(OUT2)
NetC67_1: C67.1 R36.2 U8.1(VIN-)
NetC67_2: C67.2 R46.2 U8.8(VIN+)
NetC69_1: C69.1 R40.2 U9.5(IN2+)
NetC70_1: C70.1 R42.2 U9.3(IN1+)
NetC74_1: C74.1 R41.2 R42.1
NetC74_2: C74.2 R33.2 R39.1 U9.1(OUT1)
NetC75_1: C75.1 R39.2 R40.1
NetC75_2: C75.2 R35.2 R45.1 TP12.TP(Test_Point) U9.7(OUT2)
NetC80_1: C80.1 R54.2 U10.1(VIN-)
NetC80_2: C80.2 R64.2 U10.8(VIN+)
NetC82_1: C82.1 R58.2 U7.5(IN2+)
NetC83_1: C83.1 R60.2 U7.3(IN1+)
NetC87_1: C87.1 R59.2 R60.1
NetC87_2: C87.2 R51.2 R57.1 U7.1(OUT1)
NetC88_1: C88.1 R57.2 R58.1
NetC88_2: C88.2 R53.2 R63.1 TP21.TP(Test_Point) U7.7(OUT2)
NetC93_1: C93.1 R72.2 U13.1(VIN-)
NetC93_2: C93.2 R82.2 U13.8(VIN+)
NetC95_1: C95.1 R76.2 U14.5(IN2+)
NetC96_1: C96.1 R78.2 U14.3(IN1+)
NetC100_1: C100.1 R77.2 R78.1
NetC100_2: C100.2 R69.2 R75.1 U14.1(OUT1)
NetC101_1: C101.1 R75.2 R76.1
NetC101_2: C101.2 R71.2 R81.1 TP36.TP(Test_Point) U14.7(OUT2)
NetC106_1: C106.1 R90.2 U15.1(VIN-)
NetC106_2: C106.2 R100.2 U15.8(VIN+)
NetC108_1: C108.1 R94.2 U12.5(IN2+)
NetC109_1: C109.1 R96.2 U12.3(IN1+)
NetC113_1: C113.1 R95.2 R96.1
NetC113_2: C113.2 R87.2 R93.1 U12.1(OUT1)
NetC114_1: C114.1 R93.2 R94.1
NetC114_2: C114.2 R89.2 R99.1 TP13.TP(Test_Point) U12.7(OUT2)
NetC119_1: C119.1 R108.2 U17.1(VIN-)
NetC119_2: C119.2 R118.2 U17.8(VIN+)
NetC121_1: C121.1 R112.2 U11.5(IN2+)
NetC122_1: C122.1 R114.2 U11.3(IN1+)
NetC126_1: C126.1 R113.2 R114.1
NetC126_2: C126.2 R105.2 R111.1 U11.1(OUT1)
NetC127_1: C127.1 R111.2 R112.1
NetC127_2: C127.2 R107.2 R117.1 TP22.TP(Test_Point) U11.7(OUT2)
NetC140_1: C140.1 U22.6(VBST)
NetC140_2: C140.2 L7.1 U22.2(SW)
NetC141_1: C141.1 R133.2 U25.1(OUT1)
NetC145_2: C145.2 U2.6(CAP)
NetC147_1: C147.1 L6.1 U24.2(SW)
NetC147_2: C147.2 U24.6(VBST)
NetC150_2: C150.2 R10.1
NetC151_2: C151.2 R134.1
NetC153_2: C153.2 R135.1
NetC155_2: C155.2 R137.1
NetC157_2: C157.2 R138.1
NetC158_2: C158.2 R139.1
NetC161_1: C161.1 U21.6(VBST)
NetC161_2: C161.2 L1.1 U21.2(SW)
NetC172_2: C172.2 U2.1(VAUX)
NetCU1_1: CU1.1 FB1.1 MINI_USB.1(VCC)
NetD_Power_1: D_Power.1(A) R131.1
NetD_TCK_1: D_TCK.1(A) R142.1
NetD_TDO_1: D_TDO.1(A) R143.1
NetD_USB_RX_2: D_USB_RX.2(K) R141.2
NetD_USB_TX_2: D_USB_TX.2(K) R132.2
NetFTDI_USB_UART_15: FTDI_USB_UART.15(USBDP) MINI_USB.3(D+)
NetFTDI_USB_UART_16: FTDI_USB_UART.16(USBDM) MINI_USB.2(D-)
NetJTAG_5: JTAG.5 R122.2
NetJTAG_13: JTAG.13 R123.2
NetJTAG_14: JTAG.14 R124.2
NetR1_1: R1.1 R15.2 R16.1
NetR1_2: R1.2 R17.1 R18.2
NetR2_1: R2.1 R4.2 U2.5(FB)
NetR2_2: R2.2 U2.4(VREF)
NetR3_1: R3.1 U2.3(PG)
NetR8_1: R8.1 R9.2 U24.4(VFB)
NetR10_2: R10.2 R133.1 R134.2 R135.2 R137.2 R138.2 R139.2 U25.2(IN1-)
NetR11_2: R11.2 R12.1 U1.2(IN1-)
NetR13_2: R13.2 R14.1 U1.6(IN2-)
NetR18_1: R18.1 U6.4(VOUT+)
NetR23_1: R23.1 U6.5(VOUT-)
NetR23_2: R23.2 R24.1 R27.2
NetR25_2: R25.2 R26.1 R27.1
NetR30_2: R30.2 R31.1 R36.1
NetR31_2: R31.2 R37.1 R38.2
NetR32_2: R32.2 R33.1 U9.2(IN1-)
NetR34_2: R34.2 R35.1 U9.6(IN2-)
NetR38_1: R38.1 U8.4(VOUT+)
NetR43_1: R43.1 U8.5(VOUT-)
NetR43_2: R43.2 R44.1 R47.2
NetR45_2: R45.2 R46.1 R47.1
NetR48_2: R48.2 R49.1 R54.1
NetR49_2: R49.2 R55.1 R56.2
NetR50_2: R50.2 R51.1 U7.2(IN1-)
NetR52_2: R52.2 R53.1 U7.6(IN2-)
NetR56_1: R56.1 U10.4(VOUT+)
NetR61_1: R61.1 U10.5(VOUT-)
NetR61_2: R61.2 R62.1 R65.2
NetR63_2: R63.2 R64.1 R65.1
NetR66_2: R66.2 R67.1 R72.1
NetR67_2: R67.2 R73.1 R74.2
NetR68_2: R68.2 R69.1 U14.2(IN1-)
NetR70_2: R70.2 R71.1 U14.6(IN2-)
NetR74_1: R74.1 U13.4(VOUT+)
NetR79_1: R79.1 U13.5(VOUT-)
NetR79_2: R79.2 R80.1 R83.2
NetR81_2: R81.2 R82.1 R83.1
NetR84_2: R84.2 R85.1 R90.1
NetR85_2: R85.2 R91.1 R92.2
NetR86_2: R86.2 R87.1 U12.2(IN1-)
NetR88_2: R88.2 R89.1 U12.6(IN2-)
NetR92_1: R92.1 U15.4(VOUT+)
NetR97_1: R97.1 U15.5(VOUT-)
NetR97_2: R97.2 R98.1 R101.2
NetR99_2: R99.2 R100.1 R101.1
NetR102_2: R102.2 R103.1 R108.1
NetR103_2: R103.2 R109.1 R110.2
NetR104_2: R104.2 R105.1 U11.2(IN1-)
NetR106_2: R106.2 R107.1 U11.6(IN2-)
NetR110_1: R110.1 U17.4(VOUT+)
NetR115_1: R115.1 U17.5(VOUT-)
NetR115_2: R115.2 R116.1 R119.2
NetR117_2: R117.2 R118.1 R119.1
NetR121_1: R121.1 S1.1(A1)
NetR125_1: R125.1 R126.2 U22.4(VFB)
NetR127_1: R127.1 U21.5(EN)
NetR128_1: R128.1 R145.2 U21.4(VFB)
NetR129_1: R129.1 S1.2(A2)
NetR144_1: R144.1 U22.5(EN)
NetR146_1: R146.1 U24.5(EN)
NetU25_6: U25.6(IN2-) U25.7(OUT2)

Not connected (* = marked no-connect by the designer): 12V_AGND 4 5; Ethernet_Port 3(D3) 4(D4) 5(D5) 6(D6); Foot_Switch 2(Output1); FTDI_USB_UART 2(DTR#) 6(RI#) 8(NC) 9(DSR#) 10(DCD#) 12(CBUS4) 13(CBUS2) 14(CBUS3) 19(RESET#) 24(NC) 27(OSCI) 28(OSCO); GPIO_Breakout 22; JTAG 6; MINI_USB 4(NC); S1 3(A3) 4(B3); Transceiver_Out 3(2D) 5(3D) 9(5R) 11(5B) 12(5A) 15(3Z) 16(3Y) 17(2Z) 18(2Y); U3 1(NC) 5(NC) 8(NC); U4 1(DNC) 3(TEMP) 7(NC) 8(DNC); U5 1(NC) 5(NC) 8(NC); U19 1(GPIO10) 2(GPIO11) 4(GPIO12) 5(GPIO13) 6(GPIO14) 7(GPIO15) 8(GPIO16) 9(GPIO17) 10(GPIO18) 12(GPIO19) 13(GPIO20) 14(GPIO21) 17(GPIO99) 18(GPIO8) 19(GPIO9) 22(GPIO22) 23(GPIO23) 24(GPIO24) 25(GPIO25) 27(GPIO26) 28(GPIO27) 29(ADCINC4) 38(ADCINA5) 39(ADCINA4) 44(ADCIN14) 45(ADCIN15) 48(ADCINB2) 49(ADCINB3) 60(ADCIND4) 63(GPIO30) 64(GPIO28) 65(GPIO29) 66(GPIO31) 67(GPIO32) 69(GPIO33) 70(GPIO34) 71(GPIO35) 73(FLT1) 74(FLT2) 83(GPIO36) 84(GPIO37) 85(GPIO38) 86(GPIO39) 87(GPIO40) 89(GPIO41) 90(GPIO48) 92(ERRORSTS) 93(GPIO49) 94(GPIO50) 95(GPIO51) 96(GPIO52) 97(GPIO53) 98(GPIO54) 100(GPIO55) 101(GPIO56) 102(GPIO57) 104(GPIO59) 107(GPIO61) 108(GPIO62) 109(GPIO63) 110(GPIO64) 111(GPIO65) 112(GPIO66) 113(GPIO44) 115(GPIO45) 118(GPIO133) 128(GPIO46) 129(GPIO47) 130(GPIO42) 131(GPIO43) 132(GPIO67) 160(GPIO0) 161(GPIO1) 162(GPIO2) 163(GPIO3) 164(GPIO4) 165(GPIO5) 166(GPIO6) 167(GPIO7)

## Notes on the sheet
- (near U25) NC Handled in A part
- NC Handled in A part
- Place cap close to ADC input pins
- Jack Inserted?
- Bypass Summer
- (near Transceiver_Out) SPI Clock Bypass
- Analog Input
- (near Transceiver_Out) SPI Data Bypass
- (near Foot_Switch) Power In
- Ethernet and USB Ports
- (near U3) NC
- (near U5) NC
- (near U4) NC
- (near C149) NI
- NC
- (near U19) NC
- VDDOSC
- (near C143) NI
- Debug LEDs
- VDDA
- (near C26) VDD
- (near C1) VDDIO
- BOOT
- (near C164) NI
- DSP Power
- DSP Misc
- Board Power
- (in symbol ATS100B-E) 10 MHz XTAL

## Library data of the parts
12V_AGND = Header 8: Header, 8-Pin; LatestRevisionDate: 17-Jul-2002; LatestRevisionNote: Re-released for DXP Platform.; Publisher: Altium Limited
+1V2J +3V3J +5J -5VJ = Header 2: Header, 2-Pin; LatestRevisionDate: 17-Jul-2002; LatestRevisionNote: Re-released for DXP Platform.; Publisher: Altium Limited
C1-C15 C17-C48 C50-C65 C67-C78 C80-C91 C93-C104 C106-C117 C119-C140 C142 C143 C145-C153 C155-C172 = Cap: Capacitor; Published: 8-Jun-2000; LatestRevisionDate: 17-Jul-2002; LatestRevisionNote: Re-released for DXP Platform.; PackageReference: RAD-0.3; Publisher: Altium Limited; PackageDescription: Radial Cap, Thru-Hole; 2 Leads; 0.3 in Pin Spacing
C49 = UUQ1C470MCL1GB
C141 = Cap Pol1: Polarized Capacitor (Radial); Published: 8-Jun-2000; LatestRevisionDate: 17-Jul-2002; LatestRevisionNote: Re-released for DXP Platform.; PackageReference: RB7.6-15; Publisher: Altium Limited; PackageDescription: Polarized Capacitor (Radial); 2 Leads
CU1-CU4 = Cap Pol3: Polarized Capacitor (Surface Mount); Published: 8-Jun-2000; LatestRevisionDate: 29-May-2009; LatestRevisionNote: IPC-7351 Footprint Added.; PackageReference: C0805; Publisher: Altium Limited; PackageDescription: Chip Capacitor
D1-D4 = Diode 11DQ03: Schottky Rectifier; Published: 8-Jun-2000; LatestRevisionDate: 17-Jul-2002; LatestRevisionNote: Re-released for DXP Platform.; DatasheetVersion: Dec-1997; PackageReference: DO-204AL; Publisher: Altium Limited; PackageDescription: Diode, Axial; Body 5.2 x 2.7 mm (LxDia. max), Lead Dia. 0.86 mm (max); Code_JEDEC: DO-204-AL; ComponentLink1Description: Manufacturer Link; ComponentLink1URL: http://www.irf.com/; ComponentLink2Description: Datasheet; ComponentLink2URL: http://www.irf.com/product-info/datasheets/data/11dq03.pdf
D_Power D_TCK D_TDO D_USB_RX D_USB_TX = Diode: Default Diode; Published: 8-Jun-2000; LatestRevisionDate: 17-Jul-2002; LatestRevisionNote: Re-released for DXP Platform.; PackageVersion: Sep-1996; PackageReference: SMC; Publisher: Altium Limited; PackageDescription: DO-214-AB/SMC; 2 C-Bend Leads; Body 7.9 x 5.9 mm, inc. leads (LxW); Code_JEDEC: DO-214-AB
Ethernet_Port = RJ45: pin to pad: 9>SGND
FB1 = Cap Pol3: Ferrite Bead - 0805; Value: 100pF; Published: 8-Jun-2000; LatestRevisionDate: 29-May-2009; LatestRevisionNote: IPC-7351 Footprint Added.; PackageReference: C0805; Publisher: Altium Limited; PackageDescription: Chip Capacitor
GPIO_Breakout = Header 11X2: Header, 11-Pin, Dual row; LatestRevisionDate: 17-Jul-2002; LatestRevisionNote: Re-released for DXP Platform.; Publisher: Altium Limited
JTAG = Header 7X2: Header, 7-Pin, Dual row; LatestRevisionDate: 17-Jul-2002; LatestRevisionNote: Re-released for DXP Platform.; Publisher: Altium Limited
L1 L4 L6 L7 = Inductor: Code_IEC: 1005; Published: 8-Jun-2000; LatestRevisionDate: 29-May-2009; LatestRevisionNote: IPC-7351 Footprint Added.; PackageReference: 0402-A; Publisher: Altium Limited; PackageDescription: Chip Inductor; Code_JEITA: 0402
R1-R148 = Res3: Resistor; Published: 8-Jun-2000; LatestRevisionDate: 29-May-2009; LatestRevisionNote: IPC-7351 Footprint Added.; PackageReference: J1-0603; Publisher: Altium Limited; PackageDescription: Chip Resistor
S1 = SW DIP-3: DIP Switch, 3 Position, SPST; Published: 24-Mar-1999; LatestRevisionDate: 17-Jul-2002; LatestRevisionNote: Re-released for DXP Platform.; PackageReference: DIP-6; Publisher: Altium Limited; Code_JEDEC: MO-001-AM
U1 U7 U9 U11 U12 U14 U16 U18 U20 U25 = NE5532P: Dual Low-Noise High-Speed Audio Operational Amplifier, 10 to 30 V, 0 to 70 degC, 8-pin DIP (P8), Pb-Free (RoHS); Manufacturer: Texas Instruments; CMRR(Min)(dB): 70; GBW(Typ)(MHz): 10; IIB(Max)(pA): 800000; Iq per channel(Max)(mA): 4; Number of Channels: 2; Slew Rate(Typ)(V/us): 9; Sub Family: General Purpose Amplifier, High Supply Voltage Amplifier (>=30V), Low Noise Amp (<=10nV/rtHz); Total Supply Voltage(Max)(+5V is 5, +/-5V is 10): 30; Vn at 1kHz(Typ)(nV/rtHz): 5; DatasheetVersion: SLOS075I; PackageVersion: 4040082/E, 04/2010; PackageReference: P8; PackageDescription: 8-Pin Plastic In-Line, Body 9.59 x 6.35 mm, Pitch 2.54 mm; Supplier 1: Digi-Key; Supplier Part Number 1: 296-1410-5-ND; Supplier 2: Farnell; Supplier Part Number 2: 1106092; Supplier 3: Farnell; Supplier Part Number 3: 2119505; Supplier 4: Newark; Supplier Part Number 4: 59K8751; Supplier 5: Mouser; Supplier Part Number 5: 595-NE5532P; Eco-Plan: Pb-Free (RoHS); Total Supply Voltage(Min)(+5V is 5, +/-5V is 10): 10; Vio (25C)(Max)(mV): 4; Mounting Technology: Through Hole; Code_JEDEC: MS-001; PartNumber: NE5532P; ComponentLink1Description: Manufacturer URL; ComponentLink1URL: http://www.ti.com/; ComponentLink2Description: Datasheet; ComponentLink2URL: http://www.ti.com/lit/ds/symlink/ne5532.pdf; ComponentLink3Description: Package Specification; ComponentLink3URL: http://www.ti.com/litv/pdf/mpdi001b
U2 = TPS63710DRR: Imported; Manufacturer: Texas Instruments; PartNumber: TPS63710DRR; RefDes: RefDes; TYPE: TYPE; Value: Value; Manufacturer_Part_Number: TPS63710DRR; Manufacturer_Name: Texas Instruments
U3 U5 = OPA350EA/250: High-Speed, Single-Supply, Rail-to-Rail Operational Amplifier MicroAmplifier(TM) Series, 2.7 to 5.5 V, -40 to 85 degC, 8-pin SOP (DGK8), Green (RoHS & no Sb/Br); Manufacturer: Texas Instruments; CMRR(Min)(dB): 66; IIB(Max)(pA): 10; Iq per channel(Max)(mA): 8.5; Number of Channels: 1; Offset Drift(Typ)(uV/C): 4; Slew Rate(Typ)(V/us): 22; Sub Family: Low Input Bias Current Amp (<=10pA), Low Offset Voltage Amplifier (<=500uV), Low Supply Voltage Amplifier (<=2.7V), Precision Amplifier; Total Supply Voltage(Max)(+5V is 5, +/-5V is 10): 5.5; Total Supply Voltage(Min)(+5V is 5, +/-5V is 10): 2.7; Vn at 1kHz(Typ)(nV/rtHz): 18; DatasheetVersion: SBOS099C; PackageVersion: 4073329/E, 05/2006; PackageReference: DGK8; PackageDescription: 8-Pin Thin Small Outline, Body 3 x 3 mm, Pitch 0.65 mm; Supplier 1: Digi-Key; Supplier Part Number 1: OPA350EATR-ND; Supplier 2: Digi-Key; Supplier Part Number 2: OPA350EACT-ND; Supplier 3: Digi-Key; Supplier Part Number 3: OPA350EADKR-ND; Supplier 4: Farnell; Supplier Part Number 4: 9547568; Supplier 5: Newark; Supplier Part Number 5: 75C4899; Supplier 6: Mouser; Supplier Part Number 6: 595-OPA350EA/250; Eco-Plan: Green (RoHS & no Sb/Br); Vio (25C)(Max)(mV): 1; Mounting Technology: Surface Mount; Code_JEDEC: MO-187; PartNumber: OPA350EA/250; ComponentLink1Description: Manufacturer URL; ComponentLink1URL: http://www.ti.com/; ComponentLink2Description: Datasheet; ComponentLink2URL: http://www.ti.com/general/docs/lit/getliterature.tsp?genericPartNumber=OPA350&fileType=pdf; ComponentLink3Description: Package Specification; ComponentLink3URL: http://www.ti.com/litv/pdf/mpds028d
U4 = REF5030IDGKT: Low Noise, Very Low Drift, Precision Voltage Reference, -40 to 125 degC, 8-pin MSOP (DGK), Green (RoHS & no Sb/Br); Manufacturer: Texas Instruments; Initial Accuracy @ 25/deg C(%): 0.05; Iout/Iz(Max)(mA): 10; Iq(Max)(uA): 1000; Rating: Catalog; SubFamily: Series Voltage Reference; Temp Coeff(Max)(ppm/ degree C): 3; VI(Max)(V): 18; VI(Min)(V): 3.2; DatasheetVersion: SBOS410E; PackageVersion: 4073329/E; PackageReference: DGK8; PackageDescription: 8-Pin Thin Small Outline Package 3 x 3 mm Body ,0.65 mm Pitch; Supplier 1: Digi-Key; Supplier Part Number 1: 296-24501-2-ND; Supplier 2: Digi-Key; Supplier Part Number 2: 296-24501-1-ND; Supplier 3: Digi-Key; Supplier Part Number 3: 296-24501-6-ND; Supplier 4: Newark; Supplier Part Number 4: 24R9921; Supplier 5: Mouser; Supplier Part Number 5: 595-REF5030IDGKT; Eco-Plan: Green (RoHS & no Sb/Br); VO(V): 3; Mounting Technology: Surface Mount; Code_JEDEC: MO-187; PartNumber: REF5030IDGKT; ComponentLink1Description: Manufacturer URL; ComponentLink1URL: http://www.ti.com/; ComponentLink2Description: Datasheet; ComponentLink2URL: http://www.ti.com/general/docs/lit/getliterature.tsp?genericPartNumber=REF5030&fileType=pdf; ComponentLink3Description: Package Specification; ComponentLink3URL: http://www.ti.com/litv/pdf/mpds028d
U6 U8 U10 U13 U15 U17 = THS4531IDGKR: Ultra Low Power 0.25 mA, RRO, Fully Differential Amplifier, 2.5 to 5.5 V, -40 to 125 degC, 8-pin SOP (DGK8), Green (RoHS & no Sb/Br); Manufacturer: Texas Instruments; 2nd Harmonic(dBc): -128; 3rd Harmonic(dBc): -137; BW @ Acl(MHz): 24; Io(Typ)(mA): 26; Iq per channel(Max)(mA): 0.35; Number of Channels: 1; Offset Voltage Drift (+/-)(Max)(uV/Degrees Celsius: 10; Settling Time (0.1%)(Typ)(ns): 60; Slew Rate(Typ)(V/us): 15; THD (Fc is 1 MHz)(Typ)(dB): -107; Vs(Max)(V): 5.5; Vs(Min)(V): 2.5; DatasheetVersion: SLOS358B; PackageVersion: 4073329/E, 05/2006; PackageReference: DGK8; PackageDescription: 8-Pin Thin Small Outline, Body 3 x 3 mm, Pitch 0.65 mm; Supplier 1: Digi-Key; Supplier Part Number 1: 296-30342-2-ND; Supplier 2: Digi-Key; Supplier Part Number 2: 296-30342-1-ND; Supplier 3: Digi-Key; Supplier Part Number 3: 296-30342-6-ND; Supplier 4: Mouser; Supplier Part Number 4: 595-THS4531IDGKR; Eco-Plan: Green (RoHS & no Sb/Br); SubFamily: Fully Differential Amplifier; Vio(Max)(mV): 1; Vn at Flatband(Typ)(nV/rtHz): 10; Mounting Technology: Surface Mount; Code_JEDEC: MO-187; PartNumber: THS4531IDGKR; ComponentLink1Description: Manufacturer URL; ComponentLink1URL: http://www.ti.com/; ComponentLink2Description: Datasheet; ComponentLink2URL: http://www.ti.com/general/docs/lit/getliterature.tsp?genericPartNumber=THS4531&fileType=pdf; ComponentLink3Description: Package Specification; ComponentLink3URL: http://www.ti.com/litv/pdf/mpds028d
U19 = TMS320F28379DPTP: Imported; PartNumber: TMS320F28379DPTPS; Manufacturer: Texas Instruments; RefDes: RefDes; TYPE: TYPE; Value: Value
U21 U22 = TPS563200DDCR: 17 V Input, 3A Synchronous Step-Down Regulator in SOT-23 with Advanced Eco-mode? 6-SOT -40 to 85; MF: Texas Instruments; Digi-Key_Part_Number: 296-43663-1-ND; Digi-Key_Purchase_URL: https://www.digikey.com/product-detail/en/texas-instruments/TPS563200DDCR/296-43663-1-ND/5864733?utm_source=snapeda&utm_medium=aggregator&utm_campaign=symbol; Package: TSOT-23 Texas Instruments; MP: TPS563200DDCR; SnapEDA_Link: https://www.snapeda.com/parts/TPS563200DDCR/Texas%20Instruments/view-part/?ref=snap; Value: *
U24 = TPS561208DDCR: Imported; Manufacturer: Texas Instruments; PartNumber: TPS561208DDCR; RefDes: RefDes; TYPE: TYPE; Value: Value; Manufacturer_Part_Number: TPS561208DDCR; Manufacturer_Name: Texas Instruments
12V_Input = PJ-002AH: Value: *